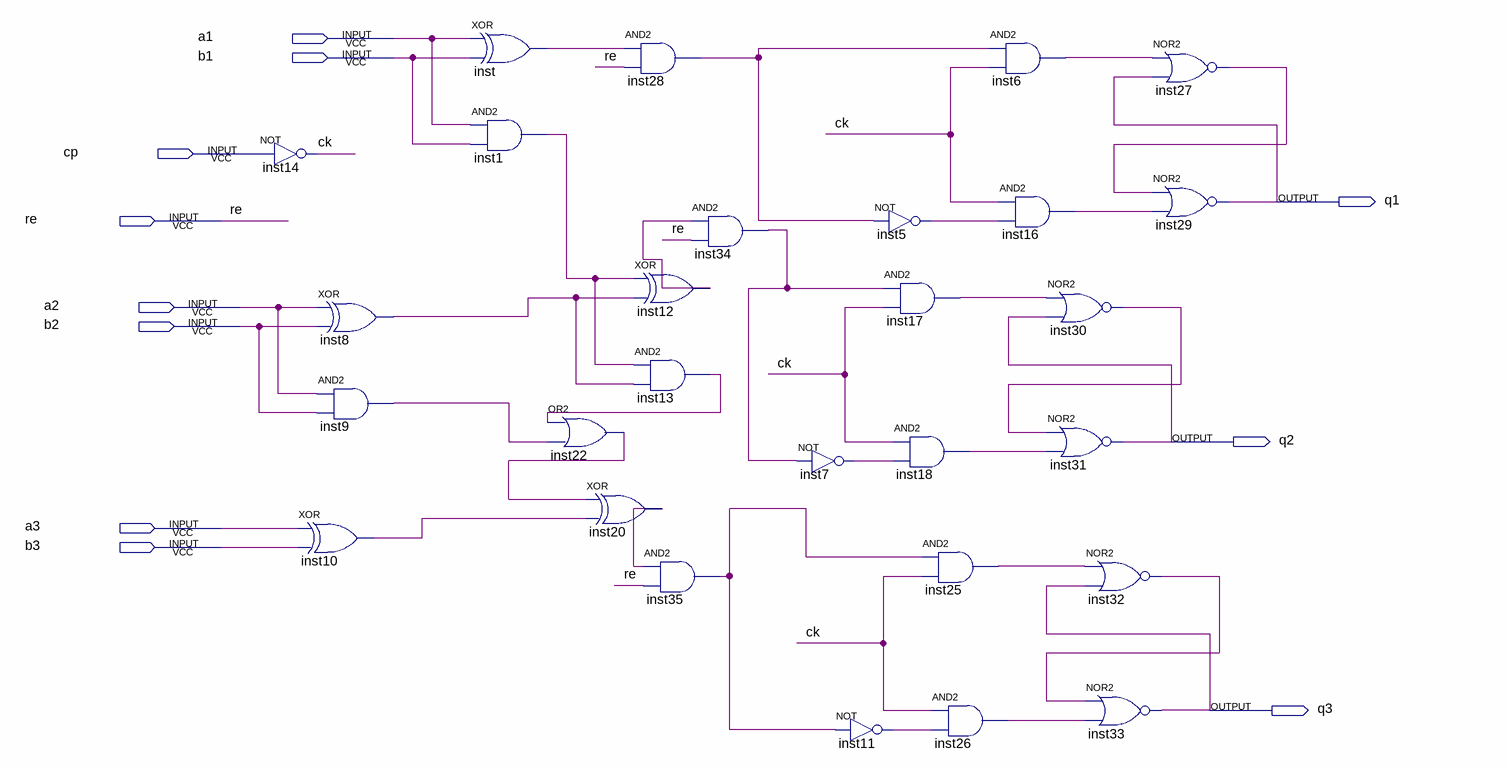
[diagram p0: schematic sheet]
// Quartus schematic work3_2.bdf as structural Verilog: 28 symbols, 11 pins
module work3_2 (
  input  a1,
  input  b1,
  input  cp,
  input  re,
  input  a2,
  input  b2,
  input  a3,
  input  b3,
  output q1,
  output q2,
  output q3
);

  wire ck, inst1_out, inst5_out, inst6_out, inst7_out, inst8_out, inst9_out, inst10_out, inst11_out,
       inst12_out, inst13_out, inst16_out, inst17_out, inst18_out, inst20_out, inst22_out, inst25_out,
       inst26_out, inst27_out, inst28_out, inst30_out, inst32_out, inst34_out, inst35_out, inst_out;

  not inst14 (ck, cp);
  xor inst8 (inst8_out, a2, b2);
  and inst9 (inst9_out, a2, b2);
  xor inst10 (inst10_out, a3, b3);
  xor inst (inst_out, a1, b1);
  and inst1 (inst1_out, a1, b1);
  or inst22 (inst22_out, inst13_out, inst9_out);
  and inst28 (inst28_out, inst_out, re);
  xor inst12 (inst12_out, inst1_out, inst8_out);
  and inst13 (inst13_out, inst1_out, inst8_out);
  xor inst20 (inst20_out, inst22_out, inst10_out);
  and inst35 (inst35_out, inst20_out, re);
  and inst34 (inst34_out, inst12_out, re);
  not inst7 (inst7_out, inst34_out);
  not inst5 (inst5_out, inst28_out);
  and inst17 (inst17_out, inst34_out, ck);
  not inst11 (inst11_out, inst35_out);
  and inst18 (inst18_out, ck, inst7_out);
  and inst25 (inst25_out, inst35_out, ck);
  and inst26 (inst26_out, ck, inst11_out);
  and inst6 (inst6_out, inst28_out, ck);
  and inst16 (inst16_out, ck, inst5_out);
  nor inst30 (inst30_out, inst17_out, q2);
  nor inst31 (q2, inst30_out, inst18_out);
  nor inst32 (inst32_out, inst25_out, q3);
  nor inst33 (q3, inst32_out, inst26_out);
  nor inst27 (inst27_out, inst6_out, q1);
  nor inst29 (q1, inst27_out, inst16_out);
endmodule
